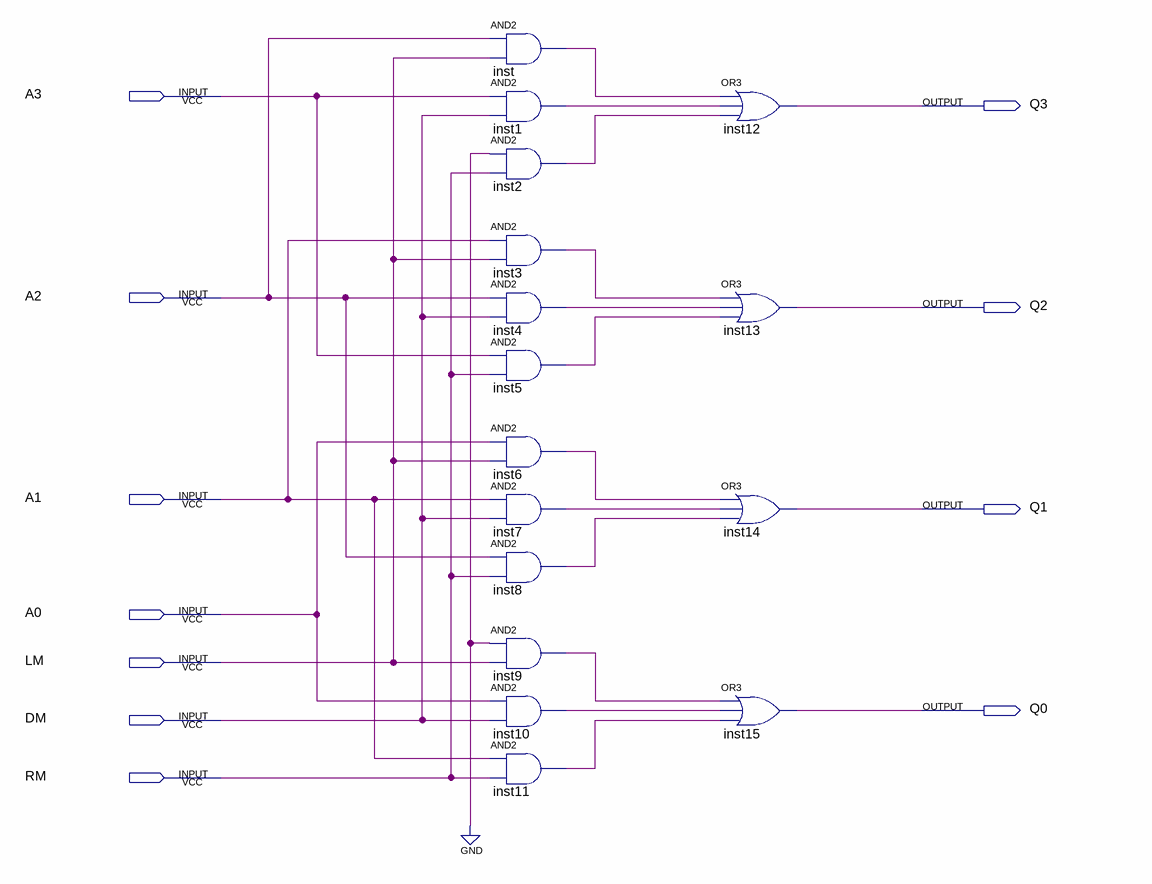
[diagram p0: schematic sheet]
// Quartus schematic shifter-4.bdf as structural Verilog: 16 symbols, 11 pins
module \shifter-4  (
  input  A3,
  input  A2,
  input  A1,
  input  A0,
  input  LM,
  input  DM,
  input  RM,
  output Q3,
  output Q2,
  output Q1,
  output Q0
);

  wire inst1_out, inst2_out, inst3_out, inst4_out, inst5_out, inst6_out, inst7_out, inst8_out, inst9_out,
       inst10_out, inst11_out, inst_out;

  and inst (inst_out, A2, LM);
  and inst1 (inst1_out, A3, DM);
  and inst2 (inst2_out, 1'b0, RM);
  and inst3 (inst3_out, A1, LM);
  and inst4 (inst4_out, A2, DM);
  and inst5 (inst5_out, A3, RM);
  and inst6 (inst6_out, A0, LM);
  and inst7 (inst7_out, A1, DM);
  and inst8 (inst8_out, A2, RM);
  and inst9 (inst9_out, 1'b0, LM);
  and inst10 (inst10_out, A0, DM);
  and inst11 (inst11_out, A1, RM);
  or inst12 (Q3, inst_out, inst1_out, inst2_out);
  or inst13 (Q2, inst3_out, inst4_out, inst5_out);
  or inst14 (Q1, inst6_out, inst7_out, inst8_out);
  or inst15 (Q0, inst9_out, inst10_out, inst11_out);
endmodule
